# EAGLE design enclosure_connectors_board (EAGLE 7.1.0)
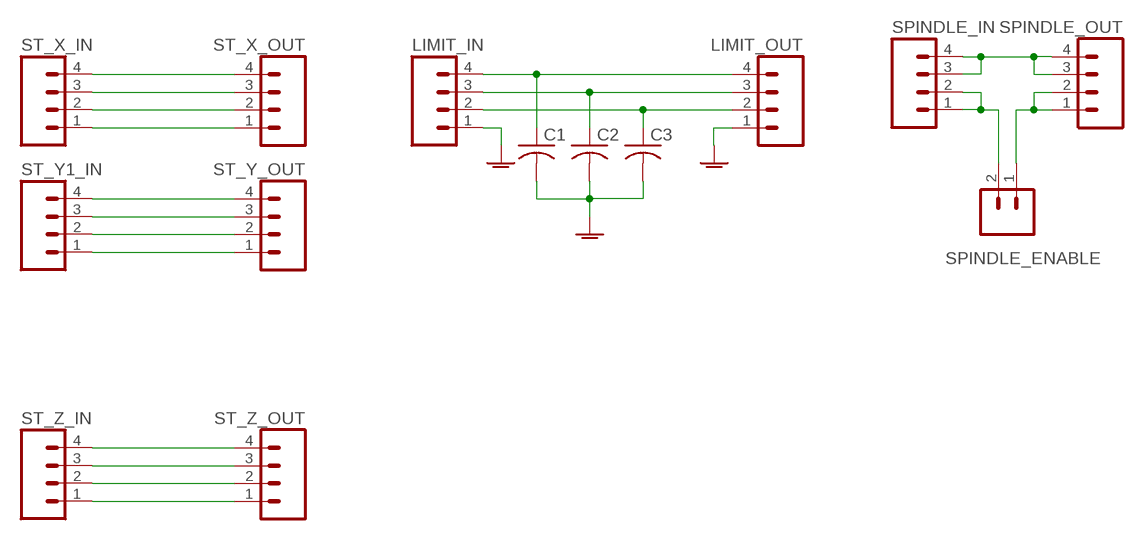
[diagram p0: schematic, sheet 1]

## Parts
C1  C-USC0805  [C0805]
C2  C-USC0805  [C0805]
C3  C-USC0805  [C0805]
LIMIT_IN  M04POLAR  [MOLEX-1X4]
LIMIT_OUT  M04PTH  [1X04]
SPINDLE_ENABLE  M02LOCK_LONGPADS  [1X02_LOCK_LONGPADS]
SPINDLE_IN  M04PTH  [1X04]
SPINDLE_OUT  M04POLAR  [MOLEX-1X4]
ST_X_IN  M04POLAR  [MOLEX-1X4]
ST_X_OUT  M04PTH  [1X04]
ST_Y1_IN  M04POLAR  [MOLEX-1X4]
ST_Y_OUT  M04PTH  [1X04]
ST_Z_IN  M04POLAR  [MOLEX-1X4]
ST_Z_OUT  M04PTH  [1X04]

## Nets
GNDA: C1.2 C2.2 C3.2 LIMIT_IN.1 LIMIT_OUT.1
N$1: ST_X_IN.4 ST_X_OUT.4
N$2: ST_X_IN.3 ST_X_OUT.3
N$3: ST_X_IN.2 ST_X_OUT.2
N$4: ST_X_IN.1 ST_X_OUT.1
N$7: ST_Y1_IN.2 ST_Y_OUT.2
N$8: ST_Y1_IN.1 ST_Y_OUT.1
N$10: C1.1 LIMIT_IN.4 LIMIT_OUT.4
N$11: C2.1 LIMIT_IN.3 LIMIT_OUT.3
N$13: ST_Z_IN.4 ST_Z_OUT.4
N$14: ST_Z_IN.3 ST_Z_OUT.3
N$15: ST_Z_IN.2 ST_Z_OUT.2
N$16: ST_Z_IN.1 ST_Z_OUT.1
N$17: C3.1 LIMIT_IN.2 LIMIT_OUT.2
N$25: ST_Y1_IN.3 ST_Y_OUT.3
N$26: ST_Y1_IN.4 ST_Y_OUT.4
SPINDLE_+: SPINDLE_IN.3 SPINDLE_IN.4 SPINDLE_OUT.3 SPINDLE_OUT.4
SPINDLE_MINUS: SPINDLE_ENABLE.2 SPINDLE_IN.1 SPINDLE_IN.2
SPINDLE_MINUS2: SPINDLE_ENABLE.1 SPINDLE_OUT.1 SPINDLE_OUT.2

## Library data of the parts
C1-C3 = rcl:C-US: CAPACITOR, American symbol
LIMIT_IN LIMIT_OUT SPINDLE_IN SPINDLE_OUT ST_X_IN ST_X_OUT ST_Y1_IN ST_Y_OUT ST_Z_IN ST_Z_OUT = SparkFun-Connectors:M04: Header 4 Standard 4-pin 0.1" header. Use with straight break away headers (SKU : PRT-00116), right angle break away headers (PRT-00553), swiss pins (PRT-00743), machine pins (PRT-00117), and female headers (PRT-00115). Molex polarized connector foot print use with SKU : PRT-08231 with associated crimp pins and housings. 1MM SMD Version SKU: PRT-10208
SPINDLE_ENABLE = SparkFun-Connectors:M02: Standard 2-pin 0.1" header. Use with - straight break away headers ( PRT-00116) - right angle break away headers (PRT-00553) - swiss pins (PRT-00743) - machine pins (PRT-00117) - female headers (PRT-00115) Molex polarized connector foot print use with: PRT-08233 with associated crimp pins and housings. 2.54_SCREWTERM for use with PRT-10571. 3.5mm Screw Terminal footprints for PRT-08084 5mm Screw Terminal footprints for use with PRT-08433

## Board
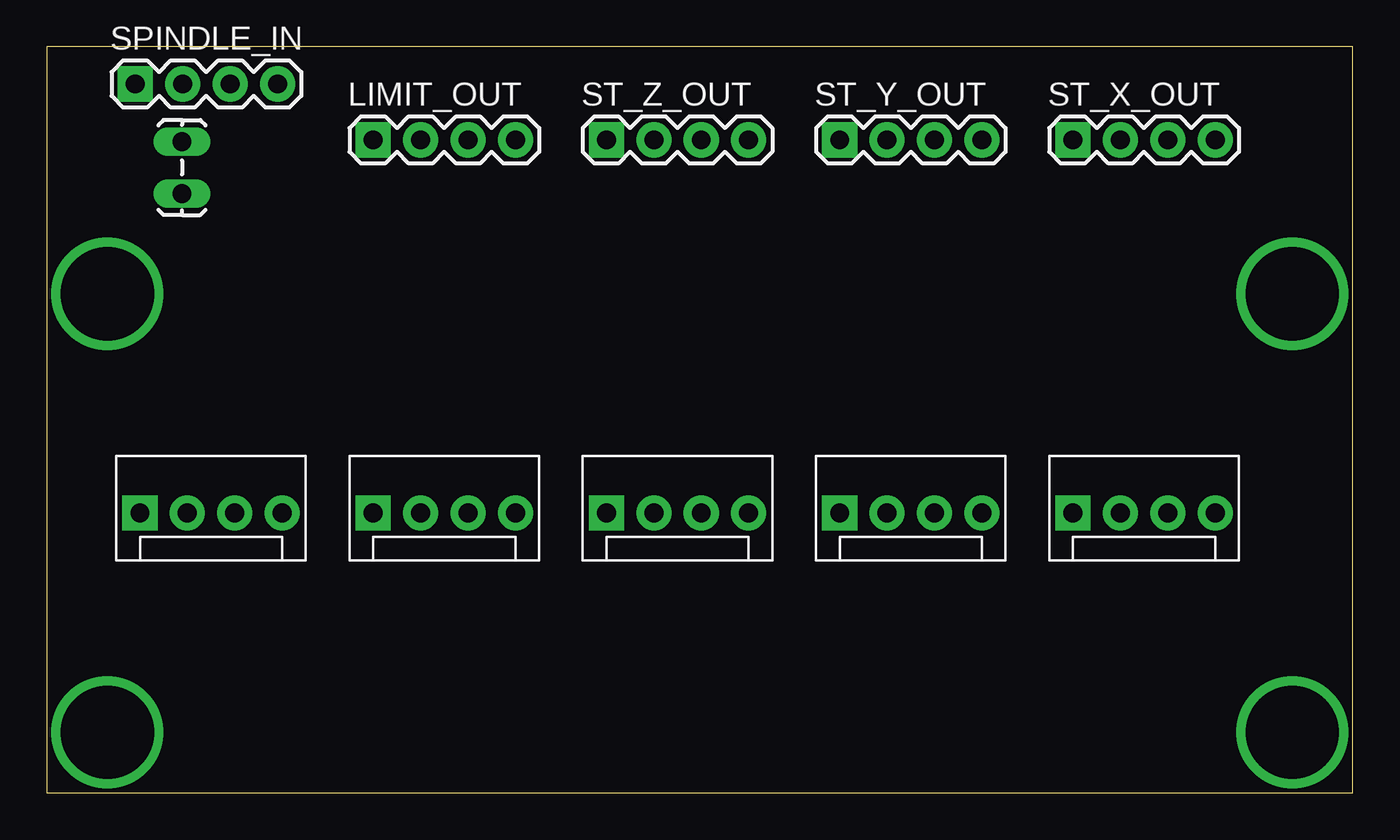
[diagram p1: board, top side]
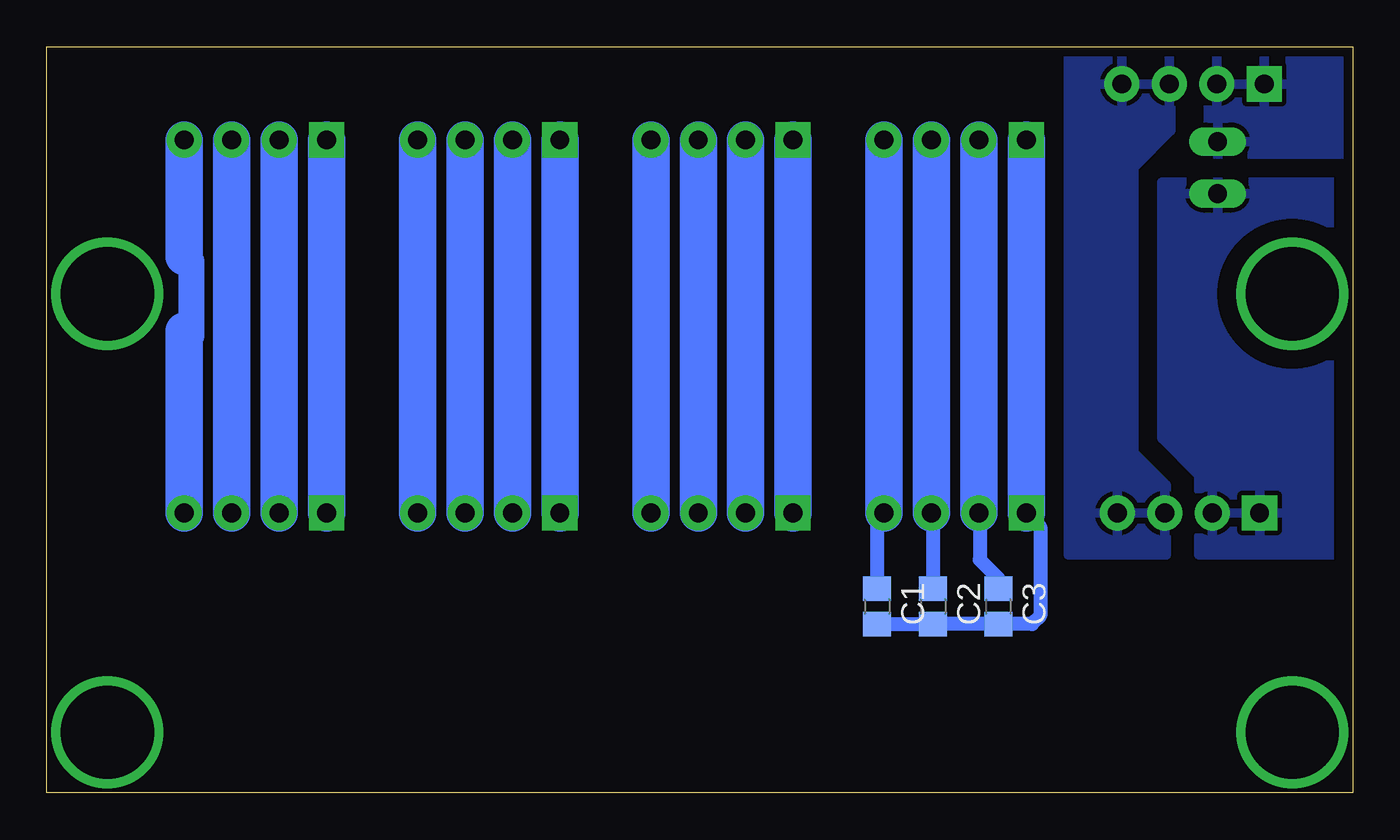
[diagram p2: board, bottom side, seen from below]

Size 70 x 40 mm. Coordinates in mm from the lower left corner, seen from the top.
Outline: 0,0 70,0 70,40 0,40 0,0
Copper layers (1*16): Top 0.035mm / dielectric 1.5mm / Bottom 0.035mm
Design rules "default *": minimum track width 10mil, minimum drill 24mil, track to track 10mil, track to pad 10mil, pad to pad 10mil, via to via 10mil, smd to smd 10mil, copper to edge 20mil, drill to drill 8mil, minimum pad ring 10mil, minimum via ring 8mil, stop-mask expansion 4mil, vias tented up to drill 0mil, thermal gap 10mil

### Footprints (pad centres in the part's own frame; a part is rotated, then mirrored left to right if it is on the bottom)
C0805 = smd 1.3 x 1.5: 1 -0.95,0; 2 0.95,0
MOLEX-1X4 = drill 1.016 pad 1.88 square: 1 0,0 | drill 1.016 pad 1.88: 2 2.54,0; 3 5.08,0; 4 7.62,0
1X04 = drill 1.016 pad 1.88 square: 1 0,0 | drill 1.016 pad 1.88: 2 2.54,0; 3 5.08,0; 4 7.62,0
1X02_LOCK_LONGPADS = drill 1.016 long: 1 -0.127,0; 2 2.667,0

### Placement (x,y rotation side)
C1  25.5,10 270 bottom
C2  22.5,10 270 bottom
C3  19,10 270 bottom
LIMIT_IN  17.5,15 0 top
LIMIT_OUT  17.5,35 0 top
SPINDLE_ENABLE  7.25,32.25 90 top
SPINDLE_IN  4.75,38 0 top
SPINDLE_OUT  5,15 0 top
ST_X_IN  55,15 0 top
ST_X_OUT  55,35 0 top
ST_Y1_IN  42.5,15 0 top
ST_Y_OUT  42.5,35 0 top
ST_Z_IN  30,15 0 top
ST_Z_OUT  30,35 0 top

### Tracks (layer width: path | path; a pad name or v marks a point on that pad's centre or on a via)
GNDA
  Bottom 0.75: LIMIT_IN.1 16.75,14.25 16.75,9.5 17.2,9.05 C3.2 C2.2 C1.2
  Bottom 2: LIMIT_OUT.1 LIMIT_IN.1
N$1
  Bottom 1.25: 62.62,28.75 62.25,28.5 | 62.25,24.5 62.62,24.75
  Bottom 1.4: 62.25,28.5 62.25,24.5
  Bottom 2: ST_X_OUT.4 62.62,28.75 | 62.62,24.75 ST_X_IN.4
N$2
  Bottom 2: ST_X_IN.3 ST_X_OUT.3
N$3
  Bottom 2: ST_X_IN.2 ST_X_OUT.2
N$4
  Bottom 2: ST_X_IN.1 ST_X_OUT.1
N$5  (via drill 5 pad 0.5)
  other vias: 3.25,26.75
N$6  (via drill 5 pad 0.5)
  other vias: 3.25,3.25
N$7
  Bottom 2: ST_Y1_IN.2 ST_Y_OUT.2
N$8
  Bottom 2: ST_Y_OUT.1 ST_Y1_IN.1
N$9  (via drill 5 pad 0.5)
  other vias: 66.75,3.25
N$10
  Bottom 0.75: LIMIT_IN.4 25.5,14.62 C1.1
  Bottom 2: LIMIT_OUT.4 LIMIT_IN.4
N$11
  Bottom 0.75: LIMIT_IN.3 22.5,14.92 C2.1
  Bottom 2: LIMIT_OUT.3 LIMIT_IN.3
N$12  (via drill 5 pad 0.5)
  other vias: 66.75,26.75
N$13
  Bottom 2: ST_Z_OUT.4 ST_Z_IN.4
N$14
  Bottom 2: ST_Z_IN.3 ST_Z_OUT.3
N$15
  Bottom 2: ST_Z_OUT.2 ST_Z_IN.2
N$16
  Bottom 2: ST_Z_OUT.1 ST_Z_IN.1
N$17
  Bottom 0.75: LIMIT_IN.2 20,14.96 20,12.5 19,11.5 C3.1
  Bottom 2: LIMIT_OUT.2 LIMIT_IN.2
N$25
  Bottom 2: ST_Y_OUT.3 ST_Y1_IN.3
N$26
  Bottom 2: ST_Y1_IN.4 ST_Y_OUT.4
SPINDLE_+
  pour Bottom: 10,12.75 10,16.5 11.75,18.25 11.75,33 11.75,33.5 9.75,35.5 9.75,39.75 15.25,39.75 15.25,12.75
SPINDLE_MINUS
  pour Bottom: 0.25,39.75 7.75,39.75 7.75,34.25 0.25,34.25
SPINDLE_MINUS2
  pour Bottom (isolate 1): 0.25,32.75 10.25,32.75 10.25,19 8.25,17 8.25,12.75 0.25,12.75